# EAGLE schematic schematic2 (EAGLE 7.2.0)
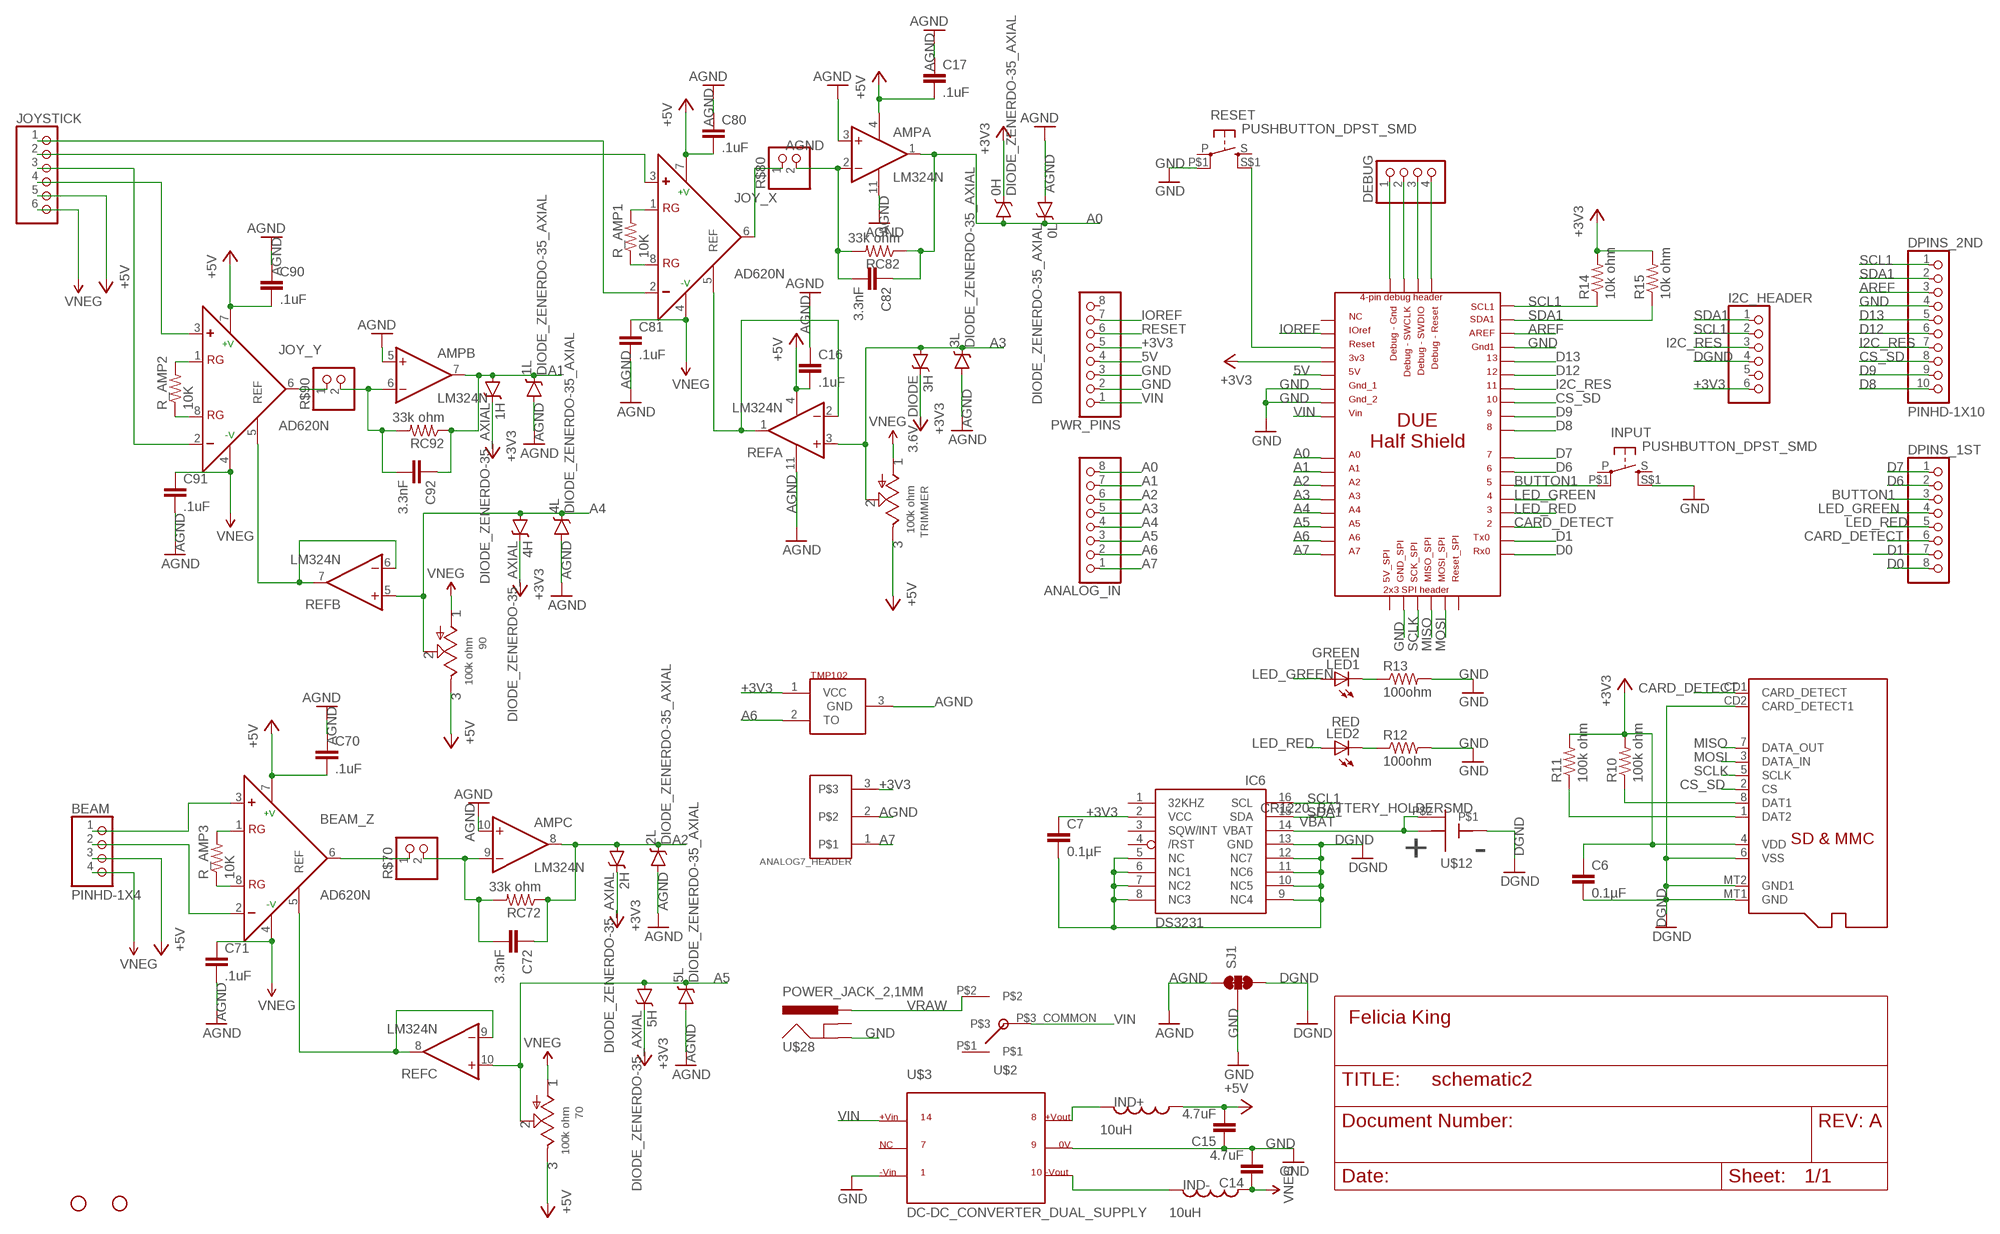
[diagram p0: schematic, sheet 1]

## Parts
0H  DIODE_ZENERDO-35_AXIAL  [DO35-7]
0L  DIODE_ZENERDO-35_AXIAL  [DO35-7]
1H  DIODE_ZENERDO-35_AXIAL  [DO35-7]
1L  DIODE_ZENERDO-35_AXIAL  [DO35-7]
2H  DIODE_ZENERDO-35_AXIAL  [DO35-7]
2L  DIODE_ZENERDO-35_AXIAL  [DO35-7]
3H  3.6V_DIODE  DIODE_ZENERDO-35_AXIAL  [DO35-7]
3L  DIODE_ZENERDO-35_AXIAL  [DO35-7]
4H  DIODE_ZENERDO-35_AXIAL  [DO35-7]
4L  DIODE_ZENERDO-35_AXIAL  [DO35-7]
5H  DIODE_ZENERDO-35_AXIAL  [DO35-7]
5L  DIODE_ZENERDO-35_AXIAL  [DO35-7]
70  100k ohm  TRIMMER_POTENTIOMETER_TT_ELEC67W  [R-TRIMMER_67W_TT_ELEC]
90  100k ohm  TRIMMER_POTENTIOMETER_TT_ELEC67W  [R-TRIMMER_67W_TT_ELEC]
AMP  LM324N  [DIL14]
ANALOG7_HEADER  PINHD-1X3  [1X03]
ANALOG_IN  PINHD-1X8CLEANBIG  [1X08-CLEANBIG]
BEAM  PINHD-1X4  PINHD-1X4LOCK  [1X04_LOCK]
BEAM_Z  AD620N  [DIL08]
C6  0.1µF  CAP0805  [0805]
C7  0.1µF  CAP0805  [0805]
C14  4.7uF  CAP0805  [0805]
C15  4.7uF  CAP0805  [0805]
C16  .1uF  CAP0805  [0805]
C17  .1uF  CAP0805  [0805]
C70  .1uF  CAP0805  [0805]
C71  .1uF  CAP0805  [0805]
C72  3.3nF  CAP0805  [0805]
C80  .1uF  CAP0805  [0805]
C81  .1uF  CAP0805  [0805]
C82  3.3nF  CAP0805  [0805]
C90  .1uF  CAP0805  [0805]
C91  .1uF  CAP0805  [0805]
C92  3.3nF  CAP0805  [0805]
DEBUG  PINHD-1X4LOCK  [1X04_LOCK]
DPINS_1ST  PINHD-1X8CLEANBIG  [1X08-CLEANBIG]
DPINS_2ND  PINHD-1X10  [1X10-BIG]
I2C_HEADER  PINHD-1X6LOCK  [1X06-LOCK]
IC6  DS3231/SO  [SO16W]
IND+  10uH  INDUCTOR0805_TY  [I_0805]
IND-  10uH  INDUCTOR0805_TY  [I_0805]
INPUT  PUSHBUTTON_DPST_SMD  [PUSHBUTTON_DPST_SMD]
JOY_X  AD620N  [DIL08]
JOY_Y  AD620N  [DIL08]
JOYSTICK  PINHD-1X6LOCK  [1X06-LOCK]
LED1  GREEN  LED  [CHIPLED_0805]
LED2  RED  LED  [CHIPLED_0805]
PWR_PINS  PINHD-1X8CLEANBIG  [1X08-CLEANBIG]
R10  100k ohm  RESISTOR_SMDR0805  [R0805]
R11  100k ohm  RESISTOR_SMDR0805  [R0805]
R12  100ohm  RESISTOR_SMDR0805  [R0805]
R13  100ohm  RESISTOR_SMDR0805  [R0805]
R14  10k ohm  RESISTOR_SMDR0805  [R0805]
R15  10k ohm  RESISTOR_SMDR0805  [R0805]
R$70  PINHD-1X2  [1X02]
R$80  PINHD-1X2  [1X02]
R$90  PINHD-1X2  [1X02]
R_AMP1  10K  RESISTOR_SMDR0805  [R0805]
R_AMP2  10K  RESISTOR_SMDR0805  [R0805]
R_AMP3  10K  RESISTOR_SMDR0805  [R0805]
RC72  33k ohm  RESISTOR_SMDR0805  [R0805]
RC82  33k ohm  RESISTOR_SMDR0805  [R0805]
RC92  33k ohm  RESISTOR_SMDR0805  [R0805]
REF  LM324N  [DIL14]
RESET  PUSHBUTTON_DPST_SMD  [PUSHBUTTON_DPST_SMD]
SJ1  JUMPER-PAD-3-NC_BY_TRACE  [PAD-JUMPER-3-3OF3_NC_BY_TRACE_YES_SILK_FULL_BOX]
STANDOFF1  STAND-OFF  [STAND-OFF]
STANDOFF2  STAND-OFF  [STAND-OFF]
TMP102  LM62  [SOT23]
TRIMMER  100k ohm  TRIMMER_POTENTIOMETER_TT_ELEC67W  [R-TRIMMER_67W_TT_ELEC]
U$1  DUE_HALF_SHIELD_A7-ANALOG  [DUE_HALF_SHIELD_A7-ANALOG]
U$2  SWITCH_SLIDE_SMD_SPDT  [SWITCH_SMD_RA_SPDT]
U$3  DC-DC_CONVERTER_DUAL_SUPPLY  [DCDC_CONVERTOR-MEV1D]
U$11  MICROSD  [MICROSD]
U$12  CR1220_BATTERY_HOLDERSMD  [CR1220_BATTERY_HOLDER_SMD]
U$28  POWER_JACK_2,1MM  [POWER_JACK_DC_2,1MM]

## Nets
5V: PWR_PINS.4 U$1.5V1(5V)
+3V3: 0H.C 1H.C 2H.C 3H.C 4H.C 5H.C ANALOG7_HEADER.3 C6.1 C7.1 I2C_HEADER.6 IC6.2(VCC) PWR_PINS.5 R10.2 R11.2 R14.2 R15.2 TMP102.1(VCC) U$1.3V3 U$11.4(VDD)
+5V: 70.P$3 90.P$3 AMP.4(P:V+) BEAM.3 BEAM_Z.7(+V) C15.2 C16.2 C17.2 C70.2 C80.2 C90.2 IND+.P$1 JOY_X.7(+V) JOY_Y.7(+V) JOYSTICK.5 REF.4(P:V+) TRIMMER.P$3
-5V: BEAM.4 C14.1 IND-.P$1 JOYSTICK.6 ; supply symbol labelled VNEG
A0: 0H.A 0L.C AMP.1(A:OUT) ANALOG_IN.8 C82.1 RC82.1 U$1.A0
A1: 1H.A 1L.C AMP.7(B:OUT) ANALOG_IN.7 C92.1 RC92.1 U$1.A1
A2: 2H.A 2L.C AMP.8(C:OUT) ANALOG_IN.6 C72.1 RC72.1 U$1.A2
A3: 3H.A 3L.C ANALOG_IN.5 REF.3(A:+IN) TRIMMER.P$2 U$1.A3
A4: 4H.A 4L.C 90.P$2 ANALOG_IN.4 REF.5(B:+IN) U$1.A4
A5: 5H.A 5L.C 70.P$2 ANALOG_IN.3 REF.10(C:+IN) U$1.A5
A6: ANALOG_IN.2 TMP102.2(TO) U$1.A6
A7: ANALOG7_HEADER.1 ANALOG_IN.1 U$1.A7
AGND: 0L.A 1L.A 2L.A 3L.A 4L.A 5L.A AMP.3(A:+IN) AMP.5(B:+IN) AMP.10(C:+IN) AMP.11(P:V-) ANALOG7_HEADER.2 C16.1 C17.1 C70.1 C71.2 C80.1 C81.2 C90.1 C91.2 REF.11(P:V-) SJ1.1 TMP102.3(GND)
AREF: DPINS_2ND.3 U$1.AREF
BUTTON1: DPINS_1ST.3 INPUT.P$1(P1) U$1.5
CARD_DETECT: DPINS_1ST.6 U$1.2 U$11.CD1(CARD_DETECT)
CS_SD: DPINS_2ND.8 U$1.10 U$11.2(CS)
D0: DPINS_1ST.8 U$1.RX0
D1: DPINS_1ST.7 U$1.TX0
D6: DPINS_1ST.2 U$1.6
D7: DPINS_1ST.1 U$1.7
D8: DPINS_2ND.10 U$1.8
D9: DPINS_2ND.9 U$1.9
D12: DPINS_2ND.6 U$1.12
D13: DPINS_2ND.5 U$1.13
DGND: C6.2 C7.2 I2C_HEADER.4 IC6.5(NC) IC6.6(NC1) IC6.7(NC2) IC6.8(NC3) IC6.9(NC4) IC6.10(NC5) IC6.11(NC6) IC6.12(NC7) IC6.13(GND) SJ1.3 U$11.6(VSS) U$11.CD2(CARD_DETECT1) U$11.MT1(GND) U$11.MT2(GND1) U$12.GND
GND: C14.2 C15.1 DPINS_2ND.4 INPUT.S$1(S1) PWR_PINS.2 PWR_PINS.3 R12.2 R13.2 RESET.P$1(P1) SJ1.2 U$1.GND1 U$1.GND_1 U$1.GND_2 U$1.GND_SPI U$3.P$1_-VIN U$3.P$9_0V U$28.P$2(GND)
I2C_RES: DPINS_2ND.7 I2C_HEADER.3 U$1.11
IOREF: PWR_PINS.7 U$1.IOREF1(IOREF)
LED_GREEN: DPINS_1ST.4 LED1.A U$1.4
LED_RED: DPINS_1ST.5 LED2.A U$1.3
MISO: U$1.MISO_SPI U$11.7(DATA_OUT)
MOSI: U$1.MOSI_SPI U$11.3(DATA_IN)
N$1: JOY_X.3(+) JOYSTICK.2
N$2: JOY_Y.1(RG) R_AMP2.2
N$3: JOY_X.6(OUT) R$80.1
N$4: BEAM_Z.6(OUT) R$70.1
N$5: JOY_X.1(RG) R_AMP1.2
N$6: JOY_X.8(RG) R_AMP1.1
N$7: JOY_Y.8(RG) R_AMP2.1
N$8: JOY_Y.6(OUT) R$90.1
N$9: BEAM_Z.1(RG) R_AMP3.2
N$10: BEAM_Z.8(RG) R_AMP3.1
N$11: AMP.2(A:-IN) C82.2 R$80.2 RC82.2
N$19: JOY_X.2(-) JOYSTICK.1
N$21: AMP.6(B:-IN) C92.2 R$90.2 RC92.2
N$23: JOY_Y.2(-) JOYSTICK.3
N$24: JOY_Y.3(+) JOYSTICK.4
N$25: AMP.9(C:-IN) C72.2 R$70.2 RC72.2
N$28: IND-.P$2 U$3.P$10_-VOUT
N$29: IND+.P$2 U$3.P$8_VOUT
N$30: R10.1 U$11.8(DAT1)
N$31: BEAM.2 BEAM_Z.2(-)
N$32: BEAM.1 BEAM_Z.3(+)
N$33: R11.1 U$11.1(DAT2)
N$35: DEBUG.1 U$1.GND_DEBUG
N$36: LED1.C R13.1
N$37: LED2.C R12.1
N$38: DEBUG.2 U$1.SWCLK_DEBUG
N$39: DEBUG.3 U$1.SWDIO_DEBUG
N$40: DEBUG.4 U$1.RESET_DEBUG
REF_BEAM: BEAM_Z.5(REF) REF.8(C:OUT) REF.9(C:-IN)
REF_JOYX: JOY_Y.5(REF) REF.6(B:-IN) REF.7(B:OUT)
REF_JOYY: JOY_X.5(REF) REF.1(A:OUT) REF.2(A:-IN)
RESET: PWR_PINS.6 RESET.S$1(S1) U$1.RESET
SCL1: DPINS_2ND.1 I2C_HEADER.2 IC6.16(SCL) R14.1 U$1.SCL1
SCLK: U$1.SCK_SPI U$11.5(SCLK)
SDA1: DPINS_2ND.2 I2C_HEADER.1 IC6.15(SDA) R15.1 U$1.SDA1
VBAT: IC6.14(VBAT) U$12.P$1(VBAT) U$12.P$2
VIN: PWR_PINS.1 U$1.VIN1(VIN) U$2.P$3_COMMON U$3.P$14_VIN
VNEG: 70.P$1 90.P$1 BEAM_Z.4(-V) C71.1 C81.1 C91.1 JOY_X.4(-V) JOY_Y.4(-V) TRIMMER.P$1
VRAW: U$2.P$2 U$28.P$1(PWR)
Unconnected: AMP.12(D:+IN) AMP.13(D:-IN) AMP.14(D:OUT) I2C_HEADER.5 IC6.1(32KHZ) IC6.3(SQW/INT) IC6.4(/RST) INPUT.P INPUT.S PWR_PINS.8 REF.12(D:+IN) REF.13(D:-IN) REF.14(D:OUT) RESET.P RESET.S U$1.5V_SPI U$1.NC1(NC) U$1.RESET_SPI U$2.P$1 U$3.P$7_NC U$28.P$3(GNDBREAK)

## Library data of the parts
0H 0L 1H 1L 2H 2L 3H 3L 4H 4L 5H 5L = Felicia_force_logger:DIODE_ZENER: Zener Diode Example: NXP Semiconductors PN NZX3V6C,133 Digikey PN 568-7963-1-ND
70 90 = miller:TRIMMER_POTENTIOMETER_TT_ELEC: Trimmer potentiometer (variable resistor) TT Electronics Series 67 http://www.bitechnologies.com/pdfs/67.pdf
AMP REF = Felicia_force_logger:LM324: OP AMP LM324 quad op amp Digikey PN 296-1391-5-ND 14-PDIP
ANALOG7_HEADER = Felicia_force_logger:PINHD-1X3: 1x3 pin header, 0.1" spacing (2.54mm)
ANALOG_IN DPINS_1ST PWR_PINS = Felicia_force_logger:PINHD-1X8: PIN HEADER "BIG" packages have 0.04" drill holes and 0.07" pad widths Regular packages should have 0.035" drills with 0.066" pad widths.
BEAM DEBUG = Felicia_force_logger:PINHD-1X4: 1x4 0.1" space header Holes are slightly staggered to help hold pins in place when soldering.
BEAM_Z JOY_X JOY_Y = Felicia_force_logger:AD620: Low Cost, Low Power, Instrumentation Amplifier Source: http://www.analog.com/UploadedFiles/Data_Sheets/37793330023930AD620_e.pdf Digikey PN AD620ANZ-ND or similar 8-DIP Digikey PN AD620ARZ-ND 8-SOIC surface mount; MF: ALTERA CORPORATION; MPN: AD620AN; OC_FARNELL: 1523782; OC_NEWARK: 05F7108
C6 C7 C14-C17 C70-C72 C80-C82 C90-C92 = Felicia_force_logger:CAP: Capacitor Standard ceramic capacitor, surface mount or 0.1" leaded capacitor.
DPINS_2ND = Felicia_force_logger:PINHD-1X10: Pin header 1x10 0.1" spacing With round pins
I2C_HEADER JOYSTICK = Felicia_force_logger:PINHD-1X6: PIN HEADER "BIG" packages have 0.04" drills appropriate for larger terminal blocks, otherwise drills are 0.035".
IC6 = Felicia_force_logger:DS3231: DS3231 Real Time Clock, I2C. Temperature-compensated crystal oscillator 16SOIC-WIDE Digikey PN DS3231SN#T&RCT-ND
IND+ IND- = Felicia_force_logger:INDUCTOR: Inductor Example: Taiyo Yuden PN LBR2012T100K
INPUT RESET = Felicia_force_logger:PUSHBUTTON_DPST_SMD: PUSHBUTTON DPST SMD Omron B3S-1000 Digikey PN SW836CT-ND
LED1 LED2 = Felicia_force_logger:LED: LEDs Standard schematic elements and footprints for 5mm, 3mm, 1206, and 0603 sized LEDs. 5mm - Spark Fun Electronics SKU : COM-00529 (and others)
R10-R15 R_AMP1-R_AMP3 RC72 RC82 RC92 = Felicia_force_logger:RESISTOR_SMD: RESISTOR, American symbol
R$70 R$80 R$90 = Felicia_force_logger:PINHD-1X2: 1x2 pin header 0.1" spacing (2.54mm)
SJ1 = Felicia_force_logger:JUMPER-PAD-3-NC_BY_TRACE
STANDOFF1 STANDOFF2 = miller:STAND-OFF: #4 Stand Off This is the mechanical footprint for a #4 phillips button head screw. Use the keepout ring to avoid running the screw head into surrounding components. SKU : PRT-00447
TMP102 = Felicia_force_logger:LM62: LM62 Analog temperature sensor SOT-23 package 480mV offset at 0C, 15.6mV/C output 2.7 to 10V supply.
TRIMMER = Felicia_force_logger:TRIMMER_POTENTIOMETER_TT_ELEC: Trimmer potentiometer (variable resistor) TT Electronics Series 67 http://www.bitechnologies.com/pdfs/67.pdf
U$1 = Felicia_force_logger:DUE_HALF_SHIELD_A7-ANALOG: Arduino Due shield Matches Uno R3 footprint, but adds Due SPI 2x3 header, debug wire 4-pin header, and adds Analog pins A6 and A7. **NOTE**The 5V pin on the Due SPI 2x3 header outputs 5V, rather than the 3V3 you might expect.
U$2 = Felicia_force_logger:SWITCH_SLIDE_SMD_SPDT: Single Pole Dual Throw switch Copal PN CSS-1210TB (surface mount, right-angle) Digikey PN 563-1091-1-ND
U$3 = Felicia_force_logger:DC-DC_CONVERTER_DUAL_SUPPLY: Murata DC-DC converter dual-supply Example: Murata PN: MEV1D1205 Digikey PN: 811-2272-ND
U$11 = Felicia_force_logger:MICROSD: Micro-SD / Transflash card holder with SPI pinout For the 3M # 2908-05WB-MG and/or 4UCON #19656 push-push type Digikey PN 3M5607CT-ND
U$12 = Felicia_force_logger:CR1220_BATTERY_HOLDER: CR1220 Battery Holder Keystone Part # 3001 Digikey 3001K-ND
U$28 = Felicia_force_logger:POWER_JACK_2,1MM: DC Power Jack, 2.1mm center pin. Digikey PN CP-202AH-ND